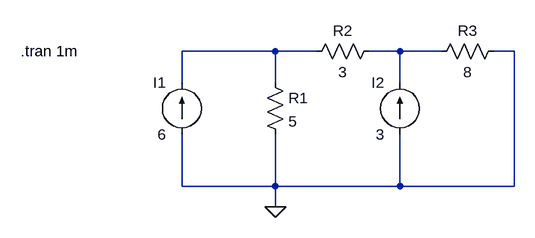
[diagram p0: schematic Q6 att 2.asc]
Q6 att 2.asc, the LTspice schematic file:
Version 4.1
SHEET 1 880 680
WIRE 112 64 -32 64
WIRE 176 64 112 64
WIRE 304 64 256 64
WIRE 368 64 304 64
WIRE 480 64 448 64
WIRE -32 112 -32 64
WIRE 112 112 112 64
WIRE 304 112 304 64
WIRE -32 272 -32 192
WIRE 112 272 112 192
WIRE 112 272 -32 272
WIRE 304 272 304 192
WIRE 304 272 112 272
WIRE 480 272 480 64
WIRE 480 272 304 272
WIRE 112 304 112 272
FLAG 112 304 0
SYMBOL current -32 192 R180
WINDOW 0 24 80 Left 2
WINDOW 3 24 0 Left 2
WINDOW 123 0 0 Left 0
WINDOW 39 0 0 Left 0
SYMATTR InstName I1
SYMATTR Value 6
SYMBOL current 304 192 R180
WINDOW 0 24 80 Left 2
WINDOW 3 24 0 Left 2
WINDOW 123 0 0 Left 0
WINDOW 39 0 0 Left 0
SYMATTR InstName I2
SYMATTR Value 3
SYMBOL res 96 96 R0
SYMATTR InstName R1
SYMATTR Value 5
SYMBOL res 272 48 R90
WINDOW 0 0 56 VBottom 2
WINDOW 3 32 56 VTop 2
SYMATTR InstName R2
SYMATTR Value 3
SYMBOL res 464 48 R90
WINDOW 0 0 56 VBottom 2
WINDOW 3 32 56 VTop 2
SYMATTR InstName R3
SYMATTR Value 8
TEXT -280 64 Left 2 !.tran 1m

The netlist it stands for:
* Q6 att 2.asc
I1 0 N001 6
I2 0 N002 3
R1 N001 0 5
R2 N002 N001 3
R3 0 N002 8
.tran 1m
.backanno
.end